# EAGLE design senseye-2 (EAGLE 7.5.0)
AUTHOR: Neal Jackson; REV: A; TITLE: SensEye-2
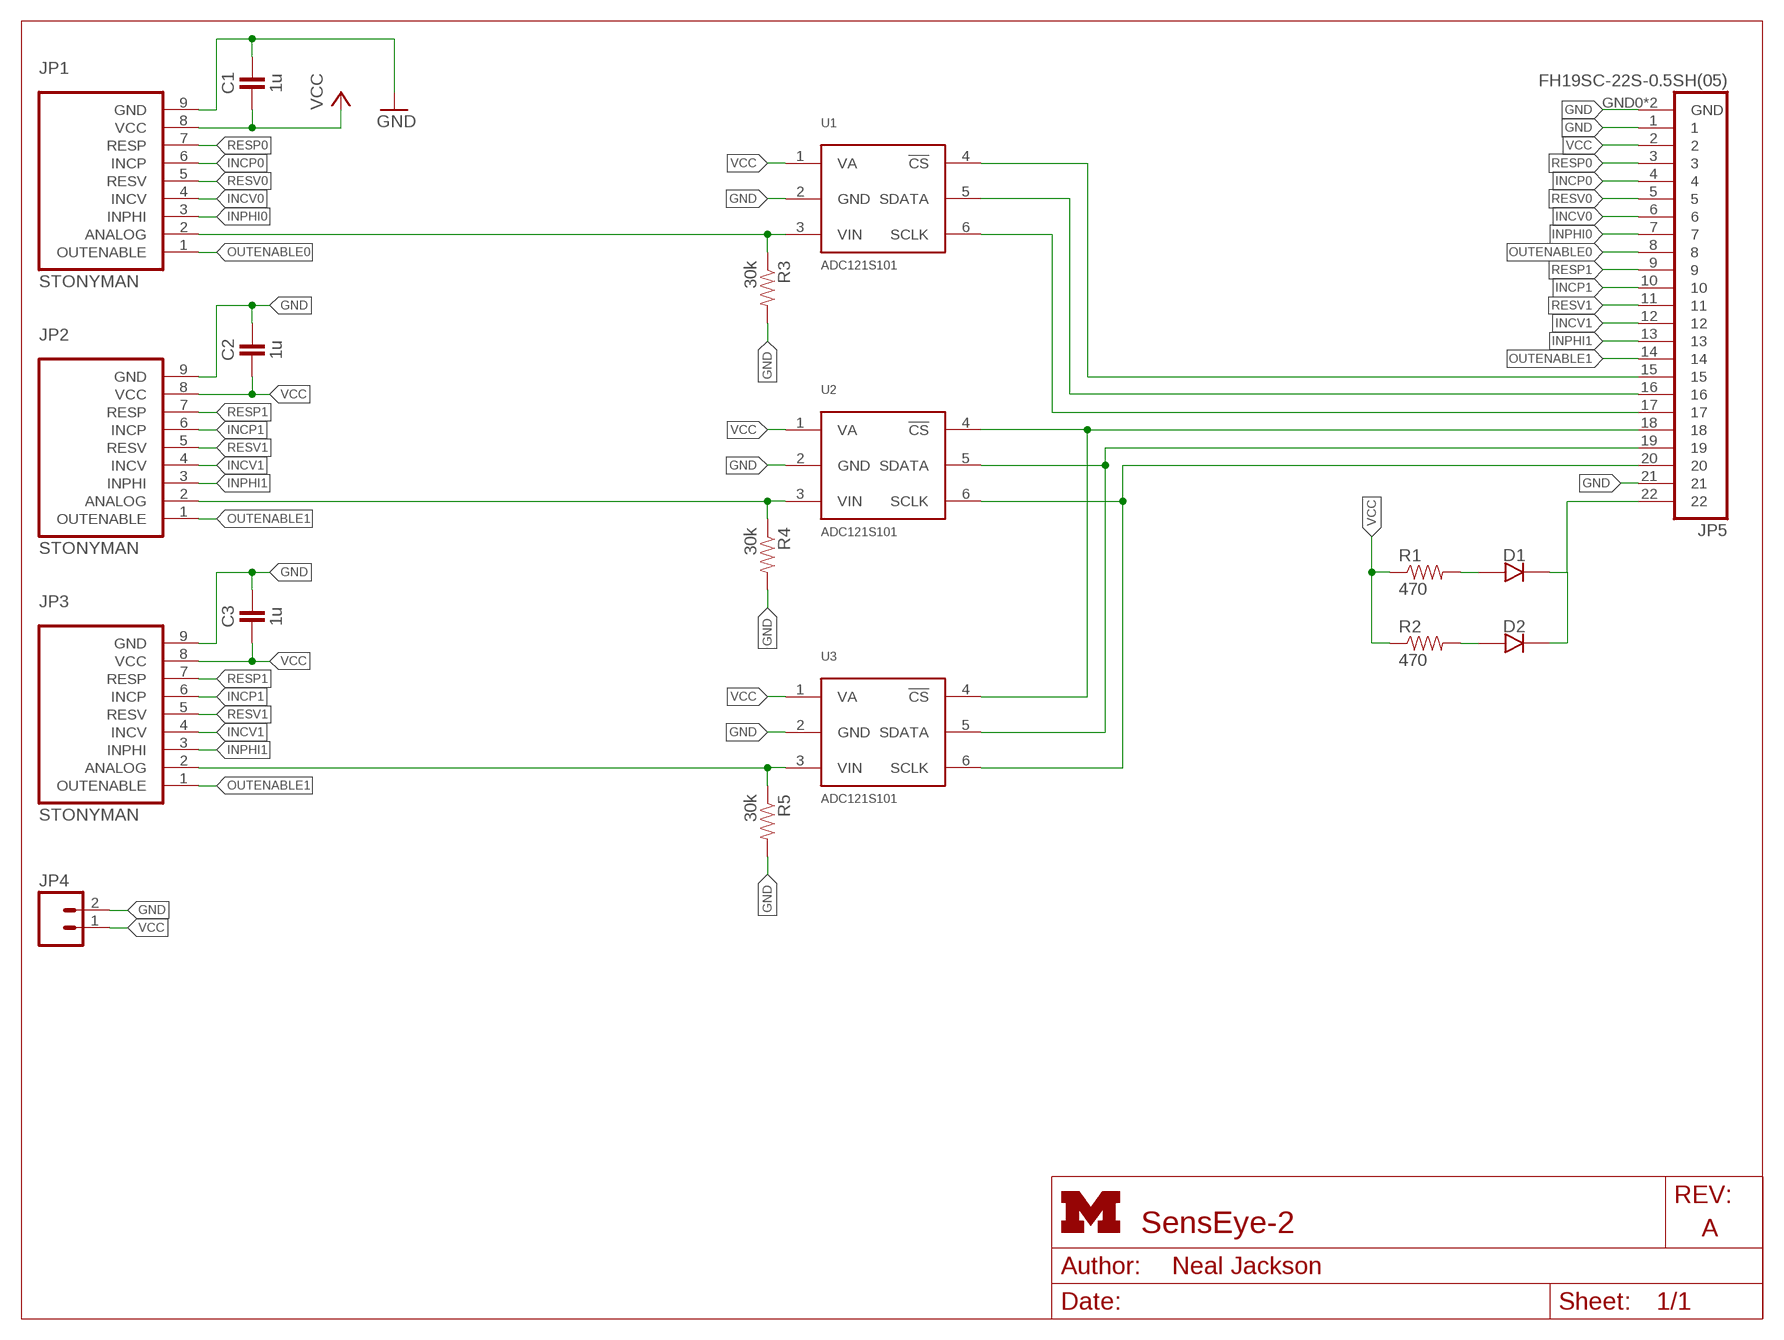
[diagram p0: schematic, sheet 1]
FRAME1 (LETTER_L): HEIGHT: 8.5in; WIDTH: 11in

## Parts
C1  1u  CAPACITOR  [0402_CAP]
C2  1u  CAPACITOR  [0402_CAP]
C3  1u  CAPACITOR  [0402_CAP]
D1  DIODE0603  [0603-DIODE]
D2  DIODE0603  [0603-DIODE]
JP1  STONYMAN  [1X09]
JP2  STONYMAN  [1X09]
JP3  STONYMAN  [1X09]
JP4  M02PTH  [1X02]
JP5  FH19SC-22S-0.5SH(05)  [FH19SC-22S-0.5SH(05)]
R1  470  RESISTOR0402_RES  [0402_RES]
R2  470  RESISTOR0402_RES  [0402_RES]
R3  30k  RESISTOR0402_RES  [0402_RES]
R4  30k  RESISTOR0402_RES  [0402_RES]
R5  30k  RESISTOR0402_RES  [0402_RES]
U1  ADC121S101  [SOT-23-6]
U2  ADC121S101  [SOT-23-6]
U3  ADC121S101  [SOT-23-6]

## Nets
!CS0: JP5.15 U1.4(!CS)
ANALOG0: JP1.2(ANALOG) R3.1 U1.3(VIN)
GND: C1.1 C2.1 C3.1 JP1.9(GND) JP2.9(GND) JP3.9(GND) JP4.2 JP5.1 JP5.21 JP5.GND0(GND) JP5.GND1(GND) R3.2 R4.2 R5.2 U1.2(GND) U2.2(GND) U3.2(GND)
INCP0: JP1.6(INCP) JP5.4
INCP1: JP2.6(INCP) JP3.6(INCP) JP5.10
INCV0: JP1.4(INCV) JP5.6
INCV1: JP2.4(INCV) JP3.4(INCV) JP5.12
INPHI0: JP1.3(INPHI) JP5.7
INPHI1: JP2.3(INPHI) JP3.3(INPHI) JP5.13
LED: D1.2(CATHODE) D2.2(CATHODE) JP5.22
N$1: JP2.2(ANALOG) R4.1 U2.3(VIN)
N$2: D1.1(ANODE) R1.2
N$3: JP3.2(ANALOG) R5.1 U3.3(VIN)
N$5: D2.1(ANODE) R2.2
N$6: JP5.18 U2.4(!CS) U3.4(!CS)
OUTENABLE0: JP1.1(OUTENABLE) JP5.8
OUTENABLE1: JP2.1(OUTENABLE) JP3.1(OUTENABLE) JP5.14
RESP0: JP1.7(RESP) JP5.3
RESP1: JP2.7(RESP) JP3.7(RESP) JP5.9
RESV0: JP1.5(RESV) JP5.5
RESV1: JP2.5(RESV) JP3.5(RESV) JP5.11
SCLK0: JP5.17 U1.6(SCLK)
SCLK1: JP5.20 U2.6(SCLK) U3.6(SCLK)
SDATA0: JP5.16 U1.5(SDATA)
SDATA1: JP5.19 U2.5(SDATA) U3.5(SDATA)
VCC: C1.2 C2.2 C3.2 JP1.8(VCC) JP2.8(VCC) JP3.8(VCC) JP4.1 JP5.2 R1.1 R2.1 U1.1(VA) U2.1(VA) U3.1(VA)

## Library data of the parts
C1-C3 = passives:CAPACITOR: 0402 Capacitor
D1 D2 = passives:DIODE
JP1-JP3 = senseye:STONYMAN: Header 9 Standard 9-pin 0.1" header. Use with straight break away headers (SKU : PRT-00116), right angle break away headers (PRT-00553), swiss pins (PRT-00743), machine pins (PRT-00117), and female headers (PRT-00115).
JP4 = SparkFun-Connectors:M02: Header 2 Standard 2-pin 0.1" header. Use with straight break away headers (SKU : PRT-00116), right angle break away headers (PRT-00553), swiss pins (PRT-00743), machine pins (PRT-00117), and female headers (PRT-00115). Molex polarized connector foot print use with SKU : PRT-08233 with associated crimp pins and housings.
JP5 = senseye:FH19SC-22S-0.5SH(05)
R1-R5 = passives:RESISTOR: Resistor Basic schematic elements and footprints for 0603, 1206, and PTH resistors.
U1-U3 = chips:ADC121S101: Analogue to Digital Converter, 12 bit, 1 MSPS, Single, 2.7 V, 5.25 V, SOT-23; DIGIKEY: ADC121S101CIMF/NOPBCT-ND; MOUSER: 926-AD121S101CISDNPB; NEWARK: 96K6188

## Board
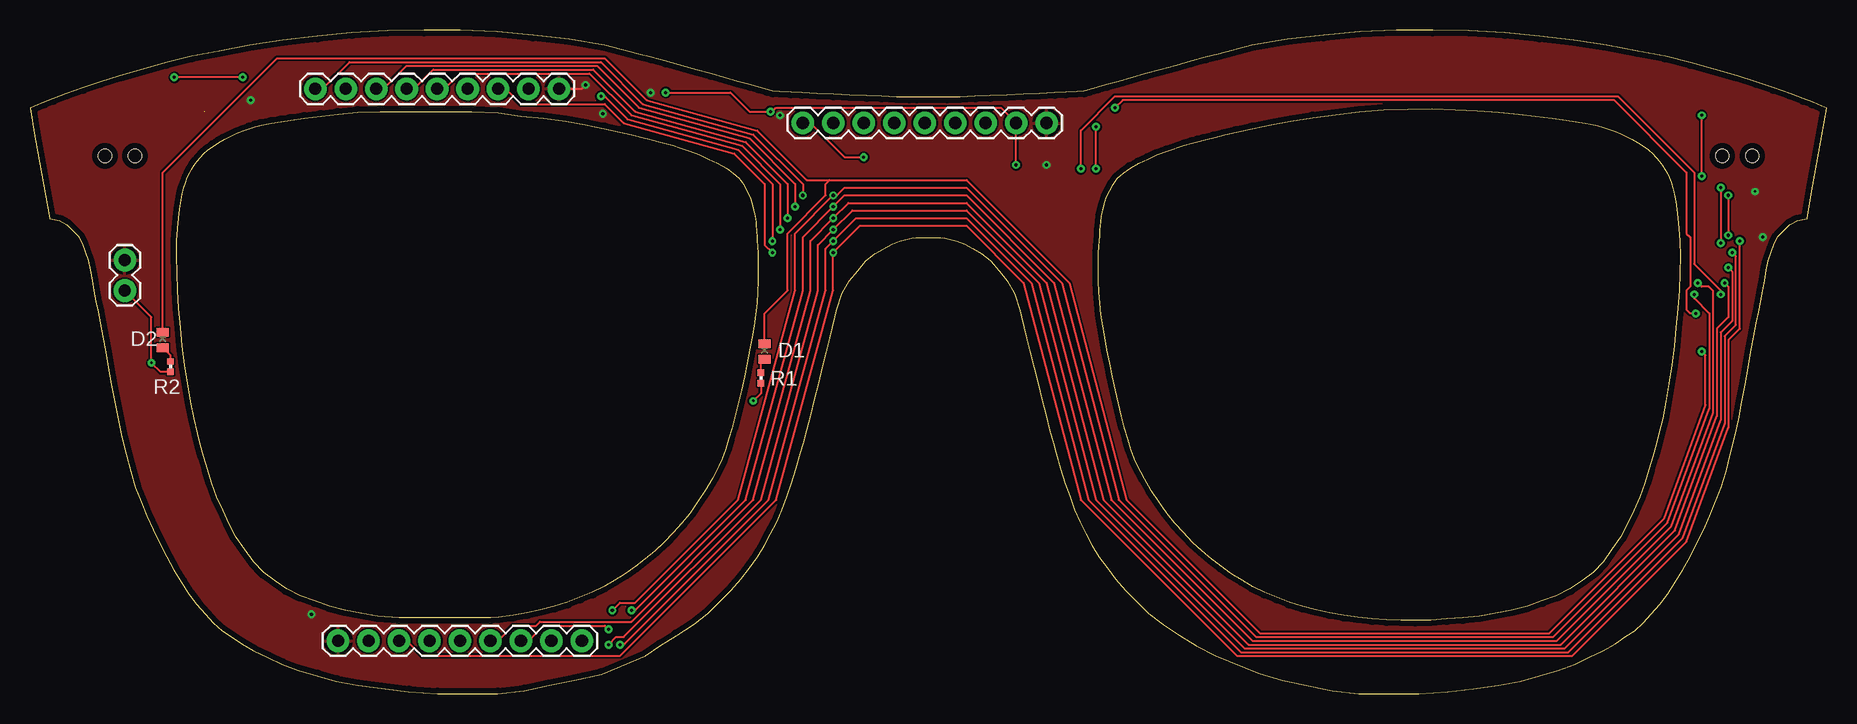
[diagram p1: board, top side]
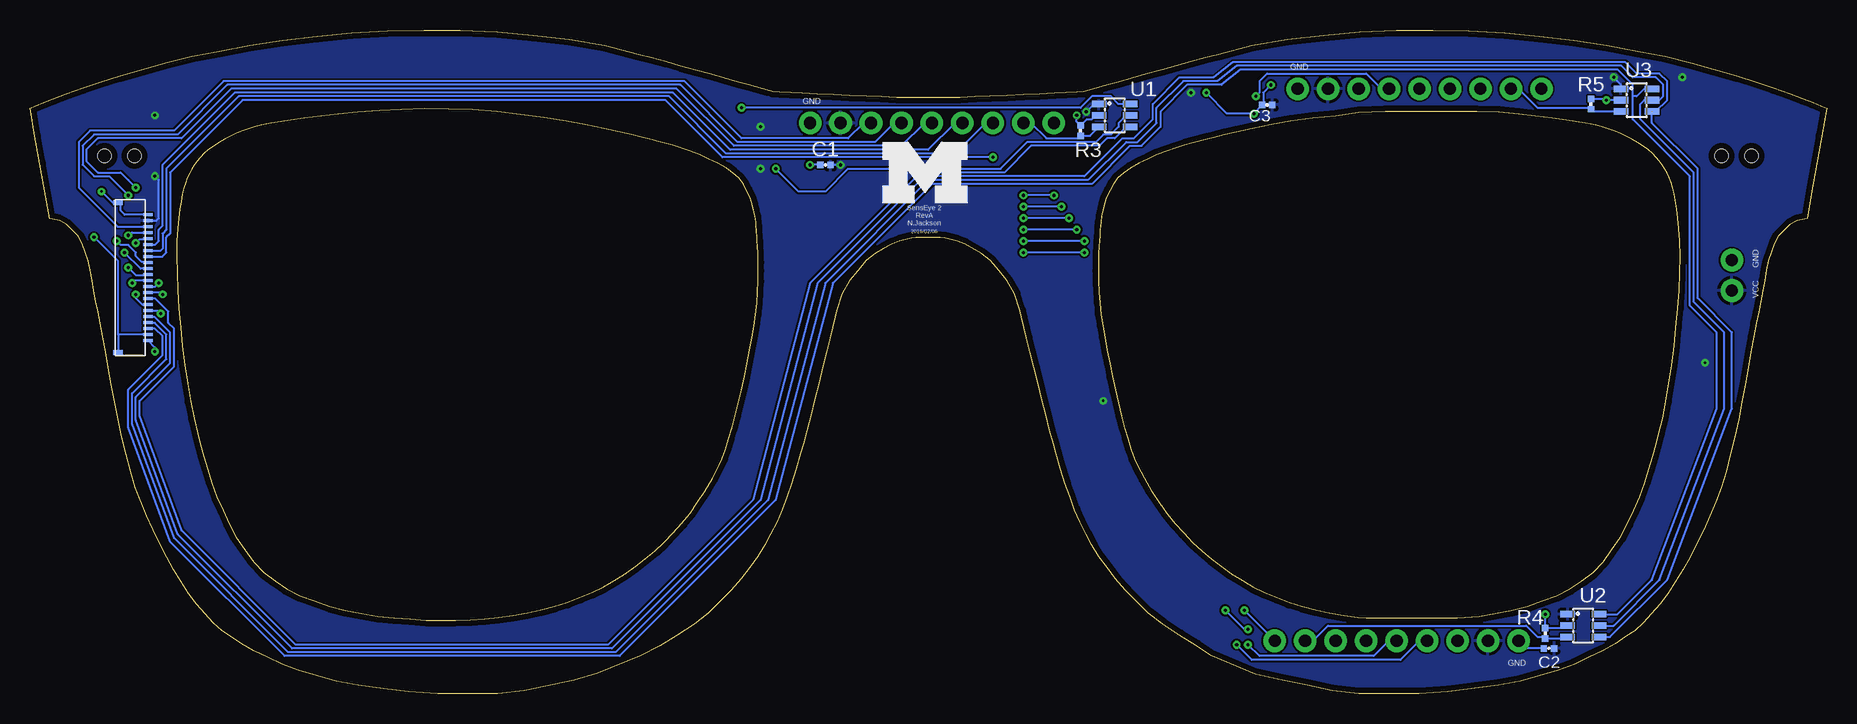
[diagram p2: board, bottom side, seen from below]

Size 149.76 x 55.34 mm. Coordinates in mm from the lower left corner, seen from the top.
Outline: 134,53.58 131.45,54.08 128.69,54.49 125.82,54.8 122.94,55.1 119.95,55.28 116.93,55.31 113.9,55.34 110.84,55.21 107.83,54.89 104.83,54.57 101.87,54.06 99.05,53.33 97.99,53.05 96.76,52.72 95.51,52.37 94.26,52.03 93,51.68 91.86,51.36 90.73,51.04 89.73,50.76 89.01,50.55 88.3,50.35 87.86,50.22 87.27,50.19 86.34,50.15 85.41,50.1 84.14,50.03 82.8,49.97 81.45,49.91 80.03,49.85 78.78,49.8 77.53,49.75 76.47,49.72 73.93,49.72 73.3,49.72 72.23,49.75 70.98,49.8 69.73,49.85 68.31,49.91 66.96,49.97 65.62,50.03 64.35,50.1 63.42,50.15 62.49,50.19 61.9,50.22 61.46,50.35 60.75,50.55 60.03,50.76 59.03,51.04 57.9,51.36 56.76,51.68 55.5,52.03 53,52.72 51.77,53.05 50.71,53.33 47.89,54.06 44.93,54.57 41.93,54.89 38.92,55.21 35.86,55.34 32.83,55.31 29.81,55.28 26.82,55.1 23.94,54.8 21.07,54.49 18.31,54.08 15.76,53.58 13.46,53.13 11.33,52.6 9.42,52.07 7.51,51.54 5.83,51 4.43,50.52 3.04,50.03 1.93,49.6 1.17,49.29 0.41,48.99 0,48.8 0.41,46.5 0.81,44.2 1.22,41.9 1.63,39.6 2.46,39.44 3.08,39.1 4.03,38.14 4.35,37.52 4.6,36.81 4.85,36.1 5.02,35.3 5.17,34.45 5.33,33.6 5.47,32.71 5.67,31.81 5.87,30.91 6.08,29.77 6.3,28.48 6.53,27.2 6.77,25.78 7.05,24.33 7.34,22.87 7.65,21.38 8.01,19.95 8.38,18.53 8.79,17.18 9.26,15.99 9.73,14.81 10.26,13.63 10.82,12.51 11.38,11.38 11.98,10.31 12.62,9.32 13.25,8.33 13.91,7.43 14.6,6.66 15.29,5.89 16,5.24 16.73,4.76 17.63,4.17 18.64,3.57 19.82,3.01 21.01,2.46 22.37,1.94 23.95,1.49 25.54,1.04 27.36,0.67 31.57,0.15 33.97,0 38.99,0 41.19,0.24 43.27,0.67 45.35,1.09 47.63,1.62 51.29,3.14 52.52,3.98 53.93,4.87 55.34,5.77 56.54,6.71 57.47,7.64 58.45,8.62 59.26,9.55 59.96,10.48 60.66,11.41 61.24,12.34 61.75,13.32 62.25,14.3 62.69,15.32 63.09,16.42 63.49,17.53 63.86,18.72 64.23,20.05 64.46,20.84 64.76,21.98 65.08,23.24 65.41,24.5 65.75,25.89 66.07,27.17 66.39,28.46 66.68,29.65 66.89,30.52 67.1,31.38 67.23,31.93 67.69,33.34 68.31,34.43 69,35.26 69.69,36.1 70.44,36.68 71.84,37.5 72.5,37.73 73,37.86 73.5,37.99 73.84,38.02 73.93,38.03 75.92,38.02 76.26,37.99 76.76,37.86 77.26,37.73 77.92,37.5 78.62,37.09 79.32,36.68 80.07,36.1 80.76,35.26 81.45,34.43 82.07,33.34 82.53,31.93 82.66,31.38 82.87,30.52 83.08,29.65 83.37,28.46 83.69,27.17 84.01,25.89 84.35,24.5 84.68,23.24 85,21.98 85.3,20.84 85.53,20.05 85.9,18.72 86.27,17.53 86.67,16.42 87.07,15.32 87.51,14.3 88.01,13.32 88.52,12.34 89.1,11.41 89.8,10.48 90.5,9.55 91.31,8.62 92.29,7.64 93.22,6.71 94.42,5.77 95.83,4.87 97.24,3.98 98.86,3.14 102.45,1.7 104.41,1.09 108.57,0.24 110.77,0 115.79,0 118.19,0.15 120.29,0.41 122.4,0.67 124.22,1.04 125.81,1.49 127.39,1.94 128.75,2.46 129.94,3.01 131.12,3.57 132.13,4.17 133.03,4.76 133.76,5.24 134.47,5.89 135.16,6.66 135.85,7.43 136.51,8.33 137.78,10.31 138.38,11.38 138.94,12.51 139.5,13.63 140.03,14.81 140.97,17.18 141.38,18.53 141.75,19.95 142.11,21.38 142.43,22.87 142.71,24.33 142.99,25.78 143.23,27.2 143.46,28.48 143.68,29.77 143.89,30.91 144.09,31.81 144.29,32.71 144.43,33.6 144.59,34.45 144.74,35.3 144.91,36.1 145.16,36.81 145.41,37.52 145.73,38.14 146.21,38.62 146.68,39.1 147.3,39.44 148.13,39.6 148.54,41.9 148.95,44.2 149.35,46.5 149.76,48.8 149.35,48.99 148.59,49.29 147.83,49.6 146.72,50.03 145.33,50.52 143.93,51 142.25,51.54 140.34,52.07 138.43,52.6 136.3,53.13 134,53.58
Outline: 60.33,30.66 60.17,29.7 59.98,28.64 59.76,27.54 59.54,26.44 59.3,25.31 58.79,23.16 58.52,22.13 58.25,21.24 57.98,20.34 57.7,19.58 57.43,19.03 56.88,17.92 56.29,16.9 55.64,15.97 55,15.03 54.32,14.18 53.59,13.4 52.86,12.61 52.09,11.9 51.27,11.25 50.46,10.59 49.61,10 48.72,9.45 47.83,8.9 46.86,8.42 45.82,8.01 44.79,7.6 43.69,7.26 42.56,6.99 41.43,6.71 40.26,6.51 39.07,6.36 38.38,6.3 30.76,6.3 28.96,6.46 27.62,6.7 26.28,6.94 24.96,7.28 23.74,7.72 22.52,8.16 21.39,8.72 20.43,9.41 19.46,10.1 18.63,11 17.91,12.01 17.2,13.01 16.6,14.13 16.09,15.28 15.58,16.42 15.16,17.58 14.82,18.68 14.48,19.78 14.21,20.81 13.99,21.68 13.67,22.92 13.39,24.36 12.91,27.38 12.71,28.97 12.55,30.54 12.4,32.11 12.3,33.65 12.26,35.06 12.21,36.47 12.23,37.74 12.32,38.77 12.4,39.66 12.48,40.39 12.69,41.64 12.82,42.15 12.97,42.59 13.12,43.03 13.29,43.4 13.5,43.74 13.7,44.08 13.94,44.39 14.49,45.03 14.86,45.35 15.3,45.65 15.73,45.95 16.22,46.23 17.24,46.72 17.77,46.94 18.27,47.11 18.78,47.28 19.26,47.41 19.67,47.48 20.12,47.57 20.92,47.69 21.72,47.82 22.87,47.99 24.27,48.16 25.67,48.33 27.32,48.49 29.17,48.53 36.79,48.53 39.03,48.44 40.92,48.13 42.83,47.98 44.68,47.72 46.28,47.42 47.87,47.12 49.21,46.82 50.15,46.6 51.09,46.37 51.63,46.23 51.93,46.16 52.41,46.03 52.89,45.9 53.55,45.72 54.28,45.47 55.01,45.23 55.81,44.93 56.57,44.58 57.33,44.23 58.04,43.83 58.6,43.39 59.1,43 59.46,42.49 59.74,41.96 60.02,41.42 60.2,40.85 60.32,40.32 60.44,39.8 60.5,39.33 60.53,38.98 60.56,38.64 60.56,38.43 60.59,38.18 60.62,37.75 60.65,37.32 60.68,36.71 60.69,35.98 60.7,35.25 60.69,34.4 60.64,33.49 60.59,32.58 60.5,31.62 60.33,30.66
Outline: 135.77,21.68 135.55,20.81 135.28,19.78 134.94,18.68 134.6,17.58 134.18,16.42 133.67,15.28 133.16,14.13 132.56,13.01 131.85,12.01 131.13,11 130.3,10.1 129.34,9.41 128.37,8.72 127.24,8.16 126.02,7.72 124.8,7.28 123.48,6.94 122.14,6.7 120.8,6.46 119.42,6.3 118.09,6.21 116.75,6.12 115.46,6.1 114.26,6.12 113.07,6.14 111.87,6.22 110.69,6.36 109.5,6.51 108.33,6.71 107.2,6.99 106.07,7.26 104.97,7.6 103.94,8.01 102.91,8.42 101.93,8.9 101.04,9.45 100.15,10 99.3,10.59 98.49,11.25 97.67,11.9 96.9,12.61 96.17,13.4 95.44,14.18 94.76,15.03 94.12,15.97 93.47,16.9 92.88,17.92 92.33,19.03 92.06,19.58 91.79,20.34 91.51,21.24 91.24,22.13 90.97,23.16 90.46,25.31 90.22,26.44 90,27.54 89.78,28.64 89.59,29.7 89.43,30.66 89.27,31.62 89.17,32.58 89.12,33.49 89.07,34.4 89.06,35.25 89.07,35.98 89.08,36.71 89.11,37.32 89.14,37.75 89.17,38.18 89.2,38.43 89.2,38.64 89.23,38.98 89.26,39.33 89.32,39.8 89.44,40.32 89.56,40.85 89.74,41.42 90.02,41.96 90.3,42.49 90.66,43 91.16,43.39 91.72,43.83 92.43,44.23 93.19,44.58 93.95,44.93 94.75,45.23 96.21,45.72 96.87,45.9 97.35,46.03 97.83,46.16 98.13,46.23 98.67,46.37 99.61,46.6 100.55,46.82 101.89,47.12 103.49,47.42 105.08,47.72 106.92,48.03 108.86,48.27 110.81,48.51 112.86,48.69 114.87,48.73 116.87,48.77 118.83,48.71 120.63,48.6 122.44,48.49 124.09,48.33 125.49,48.16 126.89,47.99 128.04,47.82 128.84,47.69 129.64,47.57 130.09,47.48 130.51,47.41 130.98,47.28 131.49,47.11 131.99,46.94 132.52,46.72 133.54,46.23 134.03,45.95 134.46,45.65 134.9,45.35 135.27,45.03 135.82,44.39 136.06,44.08 136.26,43.74 136.47,43.4 136.64,43.03 136.79,42.59 136.94,42.15 137.07,41.64 137.17,41.02 137.28,40.39 137.37,39.66 137.44,38.77 137.53,37.74 137.55,36.47 137.5,35.06 137.46,33.65 137.36,32.11 137.21,30.54 137.06,28.97 136.85,27.38 136.61,25.87 136.37,24.36 136.09,22.92 135.77,21.68
Copper layers (1*16): Top 0.0178mm / dielectric 59mil / Bottom 0.0178mm
Design rules "sunstone-2lyr_v1.0.0.3": minimum track width 6mil, minimum drill 14mil, track to track 6mil, track to pad 6mil, pad to pad 6mil, via to via 6mil, smd to smd 6mil, copper to edge 20mil, drill to drill 16mil, minimum pad ring 8mil, minimum via ring 8mil, stop-mask expansion 3mil, vias tented up to drill 50mil, thermal gap 10mil
Holes 1.1 mm at 6.26,44.83 8.76,44.83 141.06,44.83 143.56,44.83

### Footprints (pad centres in the part's own frame; a part is rotated, then mirrored left to right if it is on the bottom)
0402_CAP = smd 0.536 x 0.546: 1 -0.433,0; 2 0.433,0
0603-DIODE = smd 0.7 x 1: 1 -0.65,0; 2 0.65,0
1X09 = drill 1.016 pad 1.88: 1 0,0; 2 2.54,0; 3 5.08,0; 4 7.62,0; 5 10.16,0; 6 12.7,0; 7 15.24,0; 8 17.78,0; 9 20.32,0
1X02 = drill 1.016 pad 1.88: 1 0,0; 2 2.54,0
FH19SC-22S-0.5SH(05) = smd 0.25 x 0.8: 1 -5.25,0; 2 -4.75,0; 3 -4.25,0; 4 -3.75,0; 5 -3.25,0; 6 -2.75,0; 7 -2.25,0; 8 -1.75,0; 9 -1.25,0; 10 -0.75,0; 11 -0.25,0; 12 0.25,0; 13 0.75,0; 14 1.25,0; 15 1.75,0; 16 2.25,0; 17 2.75,0; 18 3.25,0; 19 3.75,0; 20 4.25,0; 21 4.75,0; 22 5.25,0 | smd 0.4 x 0.8: GND0 -6.25,-2.5; GND1 6.25,-2.5
0402_RES = smd 0.536 x 0.546: 1 -0.433,0; 2 0.433,0
SOT-23-6 = smd 0.55 x 1.2: 1 -0.95,-1.3; 2 0,-1.3; 3 0.95,-1.3; 4 0.95,1.3; 5 0,1.3; 6 -0.95,1.3

### Placement (x,y rotation side)
C1  83.47,44.09 0 bottom
C2  23.14,3.76 0 bottom
C3  46.64,49.09 0 bottom
D1  61.24,28.53 90 top
D2  11.08,29.48 90 top
JP1  64.42,47.58 0 top
JP2  46,4.4 180 top
JP3  23.78,50.44 0 top
JP4  7.9,33.61 90 top
JP5  139.92,34.69 270 bottom
R1  60.92,26.31 90 top
R2  11.71,27.26 90 top
R3  62.19,46.94 90 bottom
R4  23.46,5.03 90 bottom
R5  19.65,49.17 90 bottom
U1  59.34,48.21 270 bottom
U2  20.28,5.67 270 bottom
U3  15.84,49.48 270 bottom
U$1  [UMICH_SOLID_200MIL]  78.7,40.91 0 bottom

### Tracks (layer width: path | path; a pad name or v marks a point on that pad's centre or on a via)
!CS0
  Bottom 0.152: U1.4 58.38,47.26 59.34,46.31 59.97,46.31 60.61,45.67 66.32,45.67 68.54,43.45 75.53,43.45 84.74,34.24 89.5,16.15 101.56,4.08 127.6,4.08 137.12,13.61 140.62,23.13 140.62,24.4 137.76,27.26 137.76,30.43 138.24,30.91 138.24,31.86 139.31,32.94 JP5.15
ANALOG0
  Bottom 0.152: JP1.2 66.32,47.58 65.05,46.31 62.4,46.31 R3.1 61.39,46.51 U1.3
GND  (via drill 0.2, 0.25)
  Top 0.152: JP3.9 46,50.44 v46.32,50.75
  Bottom 0.152: 142.2,40.72 142.2,40.28 141.87,39.94 JP5.1 139.98,40 | 142.2,40.72 JP5.GND0 | v23.46,6.62 R4.2 21.79,5.47 U2.2 | C2.1 25.05,3.76 JP2.9 | U3.2 v18.38,49.48 18.5,49.6 R5.2 | v46.32,50.75 46.95,50.12 46.95,49.2 C3.1 47.07,49.05 v47.75,48.37 49.97,48.37 v51.72,50.12 | v62.51,48.21 62.51,47.69 R3.2 61.68,47.9 61.24,47.9 60.92,48.21 U1.2 | C1.1 v84.74,44.09 | 142.42,29.94 142.42,36.05 v144.43,38.05 | JP5.21 142.42,29.94 | 142.42,29.94 JP5.GND1 | 142.2,40.72 142.2,40.91 142.84,40.91 v143.79,41.86
  pour Top: -0.04,55.83 150.78,55.83 150.78,-0.05 -0.04,-0.05
INCP0  (via drill 0.25)
  Top 0.152: v141.57,41.55 v141.57,38.21
  Bottom 0.152: JP1.6 77.75,47.58 79.34,45.99 90.77,45.99 95.53,50.75 133.31,50.75 137.44,46.63 144.43,46.63 145.38,45.67 145.38,44.09 144.43,43.13 143.16,43.13 v141.57,41.55 | v141.57,38.21 141.49,38.21 141.25,38.45 139.93,38.45 JP5.4
INCP1  (via drill 0.25)
  Top 0.152: v49.18,4.08 49.49,4.08 61.56,16.15 66.32,33.61 66.32,37.1 v66.96,37.74 68.86,39.64 78.07,39.64 83.47,34.24 88.23,16.15 100.93,3.45 128.23,3.45 137.76,12.97 141.25,22.5 141.25,29.8 142.2,30.75 142.2,36.47 v141.89,36.78 | v61.88,37.74 61.88,42.5 59.02,45.36 49.81,47.9 47.91,49.8 v47.59,49.8
  Bottom 0.152: JP2.6 33.94,4.4 35.52,2.81 47.91,2.81 v49.18,4.08 | v61.88,37.74 v66.96,37.74 | JP3.6 37.11,50.44 38.38,51.71 46.64,51.71 47.27,51.07 47.27,50.12 v47.59,49.8 | JP5.10 140.54,35.44 v141.89,36.78
INCV0
  Bottom 0.152: JP1.4 72.67,47.58 74.89,45.36 91.4,45.36 96.17,50.12 132.68,50.12 138.71,44.09 138.71,39.01 139.03,38.69 139.03,37.74 139.33,37.44 JP5.6
INCV1  (via drill 0.25)
  Top 0.152: JP3.4 32.03,50.44 33.62,52.02 46.95,52.02 50.45,48.53 59.65,45.99 63.15,42.5 v63.15,39.64 | JP2.4 39.02,4.4 40.29,5.67 42.19,5.67 42.51,5.99 50.13,5.99 60.29,16.15 65.05,33.61 65.05,37.74 v66.96,39.64 68.23,40.91 78.07,40.91 84.74,34.24 89.5,16.15 101.56,4.08 127.6,4.08 137.12,13.61 140.62,23.13 140.62,30.43 141.57,31.39 141.57,33.93 v141.25,34.24
  Bottom 0.152: v63.15,39.64 v66.96,39.64 | JP5.12 141.06,34.44 v141.25,34.24
INPHI0
  Bottom 0.152: JP1.3 70.13,47.58 72.67,45.04 91.72,45.04 96.48,49.8 132.36,49.8 138.39,43.77 138.39,38.69 138.71,38.37 138.71,37.1 138.87,36.94 JP5.7
INPHI1  (via drill 0.25)
  Top 0.152: JP3.3 29.49,50.44 31.4,52.34 47.27,52.34 50.76,48.85 59.97,46.31 63.78,42.5 v63.78,40.59 | JP2.3 41.56,4.4 42.83,5.67 47.91,5.67 v48.22,5.35 | v50.13,6.94 50.45,6.94 59.65,16.15 64.42,33.61 64.42,38.05 v66.96,40.59 67.91,41.55 78.07,41.55 85.37,34.24 90.13,16.15 101.88,4.4 127.28,4.4 136.81,13.92 140.3,23.45 140.3,33.56 JP5.13 139.33,33.94 v139.03,34.24
  Bottom 0.152: v48.22,5.35 48.54,5.35 v50.13,6.94 | v63.78,40.59 v66.96,40.59 | 139.91,33.93 JP5.13 139.33,33.94 v139.03,34.24
LED  (via drill 0.25)
  Top 0.152: D2.2 11.08,43.45 20.6,52.98 47.91,52.98 51.4,49.48 60.61,46.94 64.73,42.82 66.64,42.82 | D1.2 61.24,31.7 63.15,33.61 63.15,38.37 66.32,41.55 66.32,42.5 66.64,42.82 | 66.64,42.82 78.07,42.82 86.64,34.24 91.4,16.15 102.52,5.03 126.65,5.03 136.17,14.56 139.66,24.08 139.66,28.21 v139.35,28.53
  Bottom 0.152: v139.35,28.53 139.35,28.87 JP5.22
N$1
  Bottom 0.152: JP2.2 42.83,4.4 41.56,5.67 25.05,5.67 24.09,4.72 23.58,4.72 R4.1 21.7,4.6 U2.3
N$2
  Top 0.152: R1.2 60.92,27.56 D1.1
N$3
  Bottom 0.152: U3.3 19.45,48.53 R5.1 19.77,48.85 24.09,48.85 25.68,50.44 JP3.2
N$5
  Top 0.152: R2.2 11.71,28.2 D2.1
N$6  (1 unrouted)
  Bottom 0.152: U2.4 18.06,4.72 13.3,9.48 7.9,23.77 7.9,30.12 10.76,32.97 10.76,43.77 14.57,47.58 14.57,48.5 14.28,48.5 13.3,49.48 13.3,51.07 13.93,51.71 15.84,51.71 16.79,52.66 49.49,52.66 51.08,51.39 53.94,51.39 56.16,49.17 56.16,47.9 57.75,46.31 58.7,46.31 61.88,43.13 75.21,43.13 84.1,34.24 88.86,16.15 101.25,3.76 127.92,3.76 137.44,13.29 140.93,22.81 140.93,24.72 138.08,27.58 138.08,30.12 139.35,31.39 139.87,31.39 JP5.18
OUTENABLE0  (via drill 0.25)
  Top 0.152: JP1.1 65.05,47.58 67.91,44.72 v69.5,44.72
  Bottom 0.152: v69.5,44.72 92.04,44.72 96.8,49.48 132.04,49.48 138.08,43.45 138.08,38.37 138.39,38.05 138.39,36.78 138.74,36.44 JP5.8
OUTENABLE1  (via drill 0.25)
  Top 0.152: JP3.1 24.41,50.44 26.63,52.66 47.59,52.66 51.08,49.17 60.29,46.63 64.42,42.5 v64.42,41.55 | v48.54,6.94 49.18,7.57 50.45,7.57 59.02,16.15 63.78,33.61 63.78,38.37 v66.96,41.55 67.27,41.55 67.91,42.18 78.07,42.18 86.01,34.24 90.77,16.15 102.2,4.72 126.96,4.72 136.49,14.24 139.98,23.77 139.98,31.7 138.71,32.97 v138.71,33.29
  Bottom 0.152: JP2.1 v48.54,6.94 | v64.42,41.55 v66.96,41.55 | 139.91,33.45 JP5.14 138.88,33.44 v138.71,33.29
RESP0
  Bottom 0.152: JP1.7 80.29,47.58 81.56,46.31 90.45,46.31 95.21,51.07 133.63,51.07 137.76,46.94 144.74,46.94 145.7,45.99 145.7,42.18 142.45,38.94 JP5.3
RESP1  (via drill 0.25)
  Top 0.152: JP2.7 31.4,4.4 32.67,3.13 49.18,3.13 62.19,16.15 66.96,33.61 v66.96,36.78 69.18,39.01 78.07,39.01 82.83,34.24 87.59,16.15 100.61,3.13 128.55,3.13 138.08,12.65 141.57,22.18 141.57,29.48 142.52,30.43 v142.52,37.74 | JP3.7 39.65,50.44 40.92,49.17 47.91,49.17 49.49,47.58 58.7,45.04 61.24,42.5 61.24,37.42 v61.88,36.78
  Bottom 0.152: v61.88,36.78 v66.96,36.78 | JP5.9 139.97,35.99 140.46,35.99 140.93,36.47 140.93,36.78 141.57,37.42 142.2,37.42 v142.52,37.74
RESV0  (via drill 0.25)
  Top 0.152: v140.93,42.18 v140.93,37.58
  Bottom 0.152: JP1.5 75.21,47.58 77.12,45.67 91.09,45.67 95.85,50.44 133,50.44 137.12,46.31 144.11,46.31 145.06,45.36 145.06,44.4 144.11,43.45 142.2,43.45 v140.93,42.18 141.57,42.82 | v140.93,37.58 140.62,37.89 139.96,37.89 JP5.5
RESV1  (via drill 0.25)
  Top 0.152: JP3.5 34.57,50.44 35.84,51.71 46.64,51.71 50.13,48.21 59.34,45.67 62.51,42.5 v62.51,38.69 | v48.22,4.08 48.86,4.72 49.49,4.72 60.92,16.15 65.69,33.61 65.69,37.42 v66.96,38.69 68.54,40.28 78.07,40.28 84.1,34.24 88.86,16.15 101.25,3.76 127.92,3.76 137.44,13.29 140.93,22.81 140.93,30.12 141.89,31.07 141.89,35.2 v141.57,35.51
  Bottom 0.152: JP2.5 36.48,4.4 37.75,3.13 47.27,3.13 v48.22,4.08 | v62.51,38.69 v66.96,38.69 | JP5.11 139.98,34.88 140.93,34.88 v141.57,35.51
SCLK0  (via drill 0.25)
  Top 0.152: v138.87,31.7 138.39,31.7 138.08,32.02 138.08,33.61 138.39,33.93 138.39,38.05 138.08,38.37 138.08,43.45 132.04,49.48 91.09,49.48 v90.45,48.85
  Bottom 0.152: U1.6 59.02,49.16 59.65,49.8 61.24,49.8 62.19,48.85 v90.45,48.85 | JP5.17 139.11,31.94 v138.87,31.7
SCLK1
  Bottom 0.152: U2.6 17.43,6.62 14.57,9.48 9.17,23.77 9.17,30.12 11.39,32.34 11.39,43.13 16.16,47.9 16.16,49.8 | 16.16,49.8 16.16,50.75 17.43,52.02 48.86,52.02 50.45,50.75 53.3,50.75 55.53,48.53 55.53,47.26 57.11,45.67 58.07,45.67 61.24,42.5 74.58,42.5 82.83,34.24 87.59,16.15 100.61,3.13 128.55,3.13 138.08,12.65 141.57,22.18 141.57,25.35 138.71,28.21 138.71,29.8 139.35,30.43 JP5.20 | U3.6 15.2,50.44 15.84,49.8 16.16,49.8
SDATA0  (via drill 0.25)
  Top 0.152: v140.93,33.29 140.93,33.61 138.71,35.83 138.71,43.45 132.36,49.8 90.45,49.8 87.59,46.94 v87.59,43.77
  Bottom 0.152: U1.5 58.38,48.21 59.02,47.58 59.02,47.26 59.65,46.63 60.29,46.63 60.92,45.99 66.64,45.99 68.86,43.77 81.56,43.77 83.47,41.86 85.69,41.86 v87.59,43.77 | v140.93,33.29 140.93,32.97 140.4,32.44 JP5.16
SDATA1
  Bottom 0.152: U2.5 17.74,5.67 13.93,9.48 8.54,23.77 8.54,30.12 11.08,32.66 11.08,43.45 15.52,47.9 15.52,49.17 15.2,49.48 U3.5 13.93,49.48 13.62,49.8 13.62,50.75 14.25,51.39 16.16,51.39 17.11,52.34 49.18,52.34 50.76,51.07 53.62,51.07 55.84,48.85 55.84,47.58 57.43,45.99 58.38,45.99 61.56,42.82 74.89,42.82 83.47,34.24 88.23,16.15 100.93,3.45 128.23,3.45 137.76,12.97 141.25,22.5 141.25,25.04 138.39,27.89 138.39,29.96 139.35,30.91 139.89,30.91 JP5.19
VCC  (via drill 0.2, 0.25)
  Top 0.152: v17.74,51.39 v12.03,51.39 | v139.35,43.13 v139.35,48.21 | v82.2,44.09 JP1.8 80.93,48.85 62.19,48.85 61.88,48.53 v61.72,48.53 59.97,48.53 58.38,50.12 v52.99,50.12 | v88.86,43.77 v88.86,47.26 | R1.1 60.92,25.04 v60.29,24.4 | R2.1 10.88,26.83 v10.12,27.58 10.12,31.39 JP4.1
  Bottom 0.152: U3.1 17.14,50.78 v17.74,51.39 | U1.1 61.09,49.16 v61.72,48.53 | JP5.2 139.23,39.44 139.03,39.64 139.03,42.82 v139.35,43.13 | C1.2 v82.2,44.09
  pour Bottom: -0.04,55.83 150.78,55.83 150.78,-0.05 -0.04,-0.05

### Text on the board
bNames: GND | GND | RevA | SensEye 2 | N.Jackson | 2016/02/06 | GND | VCC | GND